# Altium schematic sheet LED OSRAM.SchDoc
size A
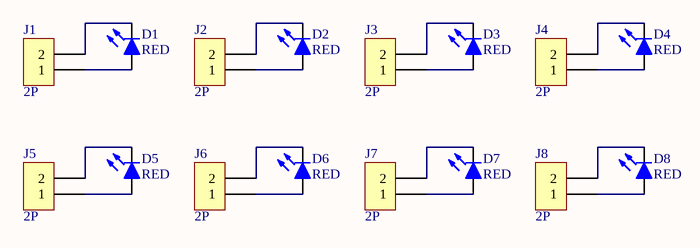
[diagram p0: LED OSRAM.SchDoc]

## Parts
D1  value RED  [OSRAM_GOLDENDRAGON]
D2  value RED  [OSRAM_GOLDENDRAGON]
D3  value RED  [OSRAM_GOLDENDRAGON]
D4  value RED  [OSRAM_GOLDENDRAGON]
D5  value RED  [OSRAM_GOLDENDRAGON]
D6  value RED  [OSRAM_GOLDENDRAGON]
D7  value RED  [OSRAM_GOLDENDRAGON]
D8  value RED  [OSRAM_GOLDENDRAGON]
J1  value 2P  [HDR1x2]
J2  value 2P  [HDR1x2]
J3  value 2P  [HDR1x2]
J4  value 2P  [HDR1x2]
J5  value 2P  [HDR1x2]
J6  value 2P  [HDR1x2]
J7  value 2P  [HDR1x2]
J8  value 2P  [HDR1x2]

## Nets
NetD1_1: D1.1(A) J1.1
NetD1_2: D1.2(K) J1.2
NetD2_1: D2.1(A) J2.1
NetD2_2: D2.2(K) J2.2
NetD3_1: D3.1(A) J3.1
NetD3_2: D3.2(K) J3.2
NetD4_1: D4.1(A) J4.1
NetD4_2: D4.2(K) J4.2
NetD5_1: D5.1(A) J5.1
NetD5_2: D5.2(K) J5.2
NetD6_1: D6.1(A) J6.1
NetD6_2: D6.2(K) J6.2
NetD7_1: D7.1(A) J7.1
NetD7_2: D7.2(K) J7.2
NetD8_1: D8.1(A) J8.1
NetD8_2: D8.2(K) J8.2

## Library data of the parts
D1-D8 = LED0: Typical INFRARED GaAs LED; Type1: LED dán 0805; Type2: LED chân cắm 3mm; Type3: LED chân cắm 5mm; Published: *; LatestRevisionDate: *; LatestRevisionNote: *; PackageReference: *; Publisher: *
J1-J8 = CON2: Type1: Giắc xanh loại nằm, 300V/16A - 5.08mm; Type2: Jump đực loại thẳng, 2.54mm; Type3: Jumper; Type4: Giắc xanh loại nằm, 300V/16A - 3.81mm; Type5: Jump đực loại cong, 2.54mm